# EasyEDA Pro project Power_Analyzer.eprj

# Schematic Schematic1
Board Name: Board1; Create Date: 2025-05-22; Page Name: P1; Project Name: Power_Analyzer; Schematic Name: Schematic1; Update Date: 2025-06-20; Company: EasyEDA.com; Page Size: A4; Version: V1.0
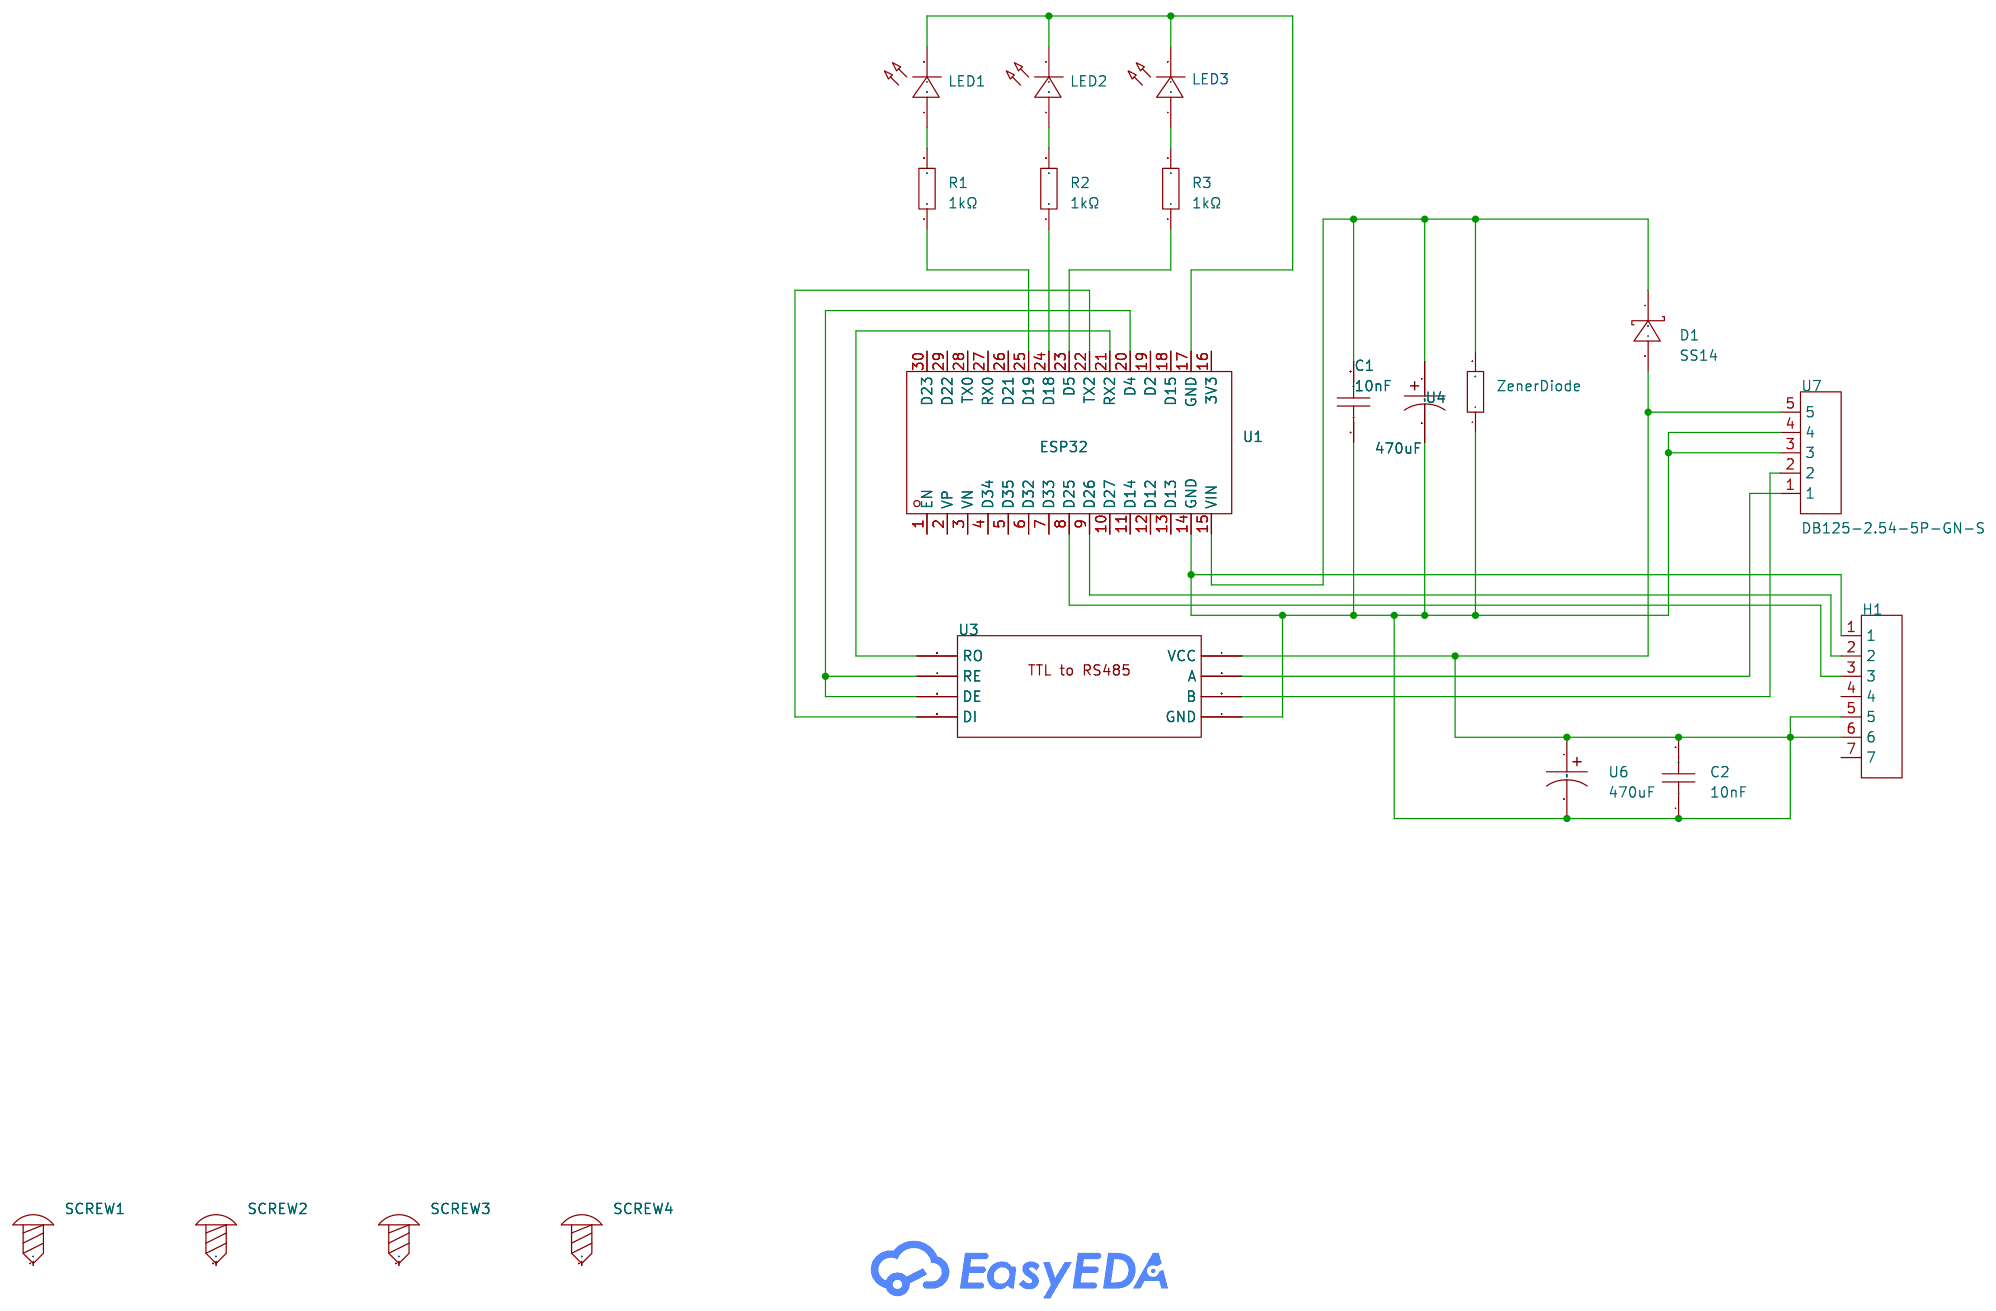
[diagram p0: schematic sheet]

## Parts
C1  10nF  [CAP-TH_L4.9-W3.7-P5.08-D0.5]
C2  10nF  [CAP-TH_L4.9-W3.7-P5.08-D0.5]
D1  SS14  [SMA_L4.2-W2.6-LS5.3-RD]
H1  -  [HDR-TH_7P-P2.54-V-M]
LED1  -  [LED-TH_BD3.0-P2.54-FD]
LED2  -  [LED-TH_BD3.0-P2.54-FD]
LED3  -  [LED-TH_BD3.0-P2.54-FD]
R1  1kΩ  [RES-TH_BD1.8-L3.2-P7.20-D0.4]
R2  1kΩ  [RES-TH_BD1.8-L3.2-P7.20-D0.4]
R3  1kΩ  [RES-TH_BD1.8-L3.2-P7.20-D0.4]
SCREW1  -  [Screw-Hole-M2]
SCREW2  -  [Screw-Hole-M2]
SCREW3  -  [Screw-Hole-M2]
SCREW4  -  [Screw-Hole-M2]
U1  ESP32  [COMM-TH_L43.7-W25.4-P2.54_NODEMCU]
U3  -  [HDR-TH_8P-P2.54-V-F-R2-C4-S2.54-1]
U4  470uF  [CAP-TH_BD8.0-P3.50-D0.5-FD]
U6  470uF  [CAP-TH_BD8.0-P3.50-D0.5-FD]
U7  DB125-2.54-5P-GN-S  [CONN-TH_DB125-2.54-5P-GN]
ZenerDiode  10kΩ  [RES-TH_BD1.8-L3.2-P7.20-D0.4]

## Library data of the parts
C1 C2 = CC4-0805-CG-50V-0.01μF-J: LCSC Part Name: 10nF ±5% 50V; Supplier Part: C454414; Manufacturer: TORCH(火炬); Supplier Footprint: 插件,P=5.08mm; JLCPCB Part Class: Extended Part; Datasheet: https://atta.szlcsc.com/upload/public/pdf/source/20191118/C454606_87A680F8831C36D0FED68C45C730D46C.pdf; Supplier: LCSC; Tolerance: ±5%; Voltage Rating: 50V
D1 = SS14_C466498: Voltage - Forward(Vf@If):550mV@1A Voltage - DC Reverse(Vr):40V Current - Rectified:1A; LCSC Part Name: 电压:40V 电流:1A; Supplier Part: C466498; Manufacturer: High Diode(海德); Supplier Footprint: SMAG; JLCPCB Part Class: Extended Part; Datasheet: https://atta.szlcsc.com/upload/public/pdf/source/20191203/C466498_7630C082BAD062E870A515CCACFD1D83.pdf; Supplier: LCSC; Voltage - Forward(Vf@If): 550mV@1A; Voltage - DC Reverse(Vr): 40V; Current - Rectified: 1A
H1 = HDR-M_2.54_1x7P: Supplier Footprint: Through
LED1-LED3 = LED_TH-R_3mm: Supplier Footprint: Through
R1-R3 ZenerDiode = Res_AXIAL-1/8W: Supplier Footprint: Through
SCREW1-SCREW4 = Screw-Hole-M2: Supplier Footprint: 插件
U1 = NODEMCU(12S): CPU:- ROM Size:- Number of I/O: USB:- WIFI Protocols:- Bluetooth:- Ethernet:- Audio & Video Interface:- Multimedia Support:- Card Type:- Power Supply Type:- Power Supply:- POE Support:- Resolution:- Temperature Range:-; LCSC Part Name: wifi测试板 NODEMCU(12S); Supplier Part: C2764073; Manufacturer: Ai-Thinker(安信可); JLCPCB Part Class: Extended Part; Datasheet: https://atta.szlcsc.com/upload/public/pdf/source/20210401/C2764073_24755F314752A2828420B4B3FC3498D8.pdf; Supplier: LCSC
U3 = HDR-F-2.54_2x4: Supplier Footprint: Through
U4 U6 = 25V470uF CD110: LCSC Part Name: 470uF ±20% 25V; Supplier Part: C2960234; Manufacturer: HRK(鸿瑞凯电子); Supplier Footprint: 插件,D8xL12mm; JLCPCB Part Class: Extended Part; Datasheet: https://atta.szlcsc.com/upload/public/pdf/source/20220224/123D914837BFA78A3349BA812F212800.pdf; Supplier: LCSC; Tolerance: ±20%; Voltage Rating: 25V; Pin Spacing: 3.5mm; Diameter: 8mm; Height - Seated (Max): 12mm; Operating Temperature: -40℃~+105℃
U7 = DB125-2.54-5P-GN-S: LCSC Part Name: 1x5P 2.54mm 直插 排数:1 每排P数:5; Supplier Part: C918123; Manufacturer: DORABO(地博电气); Supplier Footprint: 插件,P=2.54mm; JLCPCB Part Class: Extended Part; Datasheet: https://atta.szlcsc.com/upload/public/pdf/source/20230106/BCD3A0BE1EB95DC3E813F1745F022035.pdf; Supplier: LCSC; Number of Positions or Pins: 1x5P; Pitch: 2.54mm; Color: Green; Mounting Type: Direct Insert; Number of Pins: 5P; Number of Rows: 1; Number of PINs Per Row: 5; Current Rating: 7A; Voltage Rating (Max): 150V; Wire Gauge - AWG: 18~26; Wire Gauge - mm2: 1; Operating Temperature: -40℃~+105℃

## Nets
$1N619: LED1.1(C) R1.2
$1N667: LED3.1(C) R3.2
$1N692: LED2.1(C) R2.2
$1N776: LED1.2(A) LED2.2(A) LED3.2(A) U1.17(GND)
$1N1442: R3.1 U1.23(D5)
$1N1448: R1.1 U1.25(D19)
$1N1455: R2.1 U1.24(D18)
$1N3122: U1.21(RX2) U3.8(RO)
$1N3135: U1.20(D4) U3.6(DE) U3.7(RE)
$1N3158: U1.22(TX2) U3.5(DI)
$1N4323: C1.2 D1.1(C) U1.15(VIN) U4.1 ZenerDiode.2
$1N5452: U3.2(B) U7.2
$1N6480: H1.2 U1.9(D26)
$1N6507: H1.3 U1.8(D25)
$1N6725: U3.3(A) U7.1
$1N7495: C1.1 C2.1 C2.2 D1.2(A) H1.1 H1.5 H1.6 U1.14(GND) U3.1(GND) U3.4(VCC) U4.2 U6.1 U6.2 U7.3 U7.4 U7.5 ZenerDiode.1

Not connected (* = marked no-connect by the designer): H1 4 7; SCREW1 1; SCREW2 1; SCREW3 1; SCREW4 1; U1 1(EN) 2(VP) 3(VN) 4(D34) 5(D35) 6(D32) 7(D33) 10(D27) 11(D14) 12(D12) 13(D13) 16(3V3) 18(D15) 19(D2) 26(D21) 27(RX0) 28(TX0) 29(D22) 30(D23)

## Notes on the sheet
- LED3

# Board PCB1
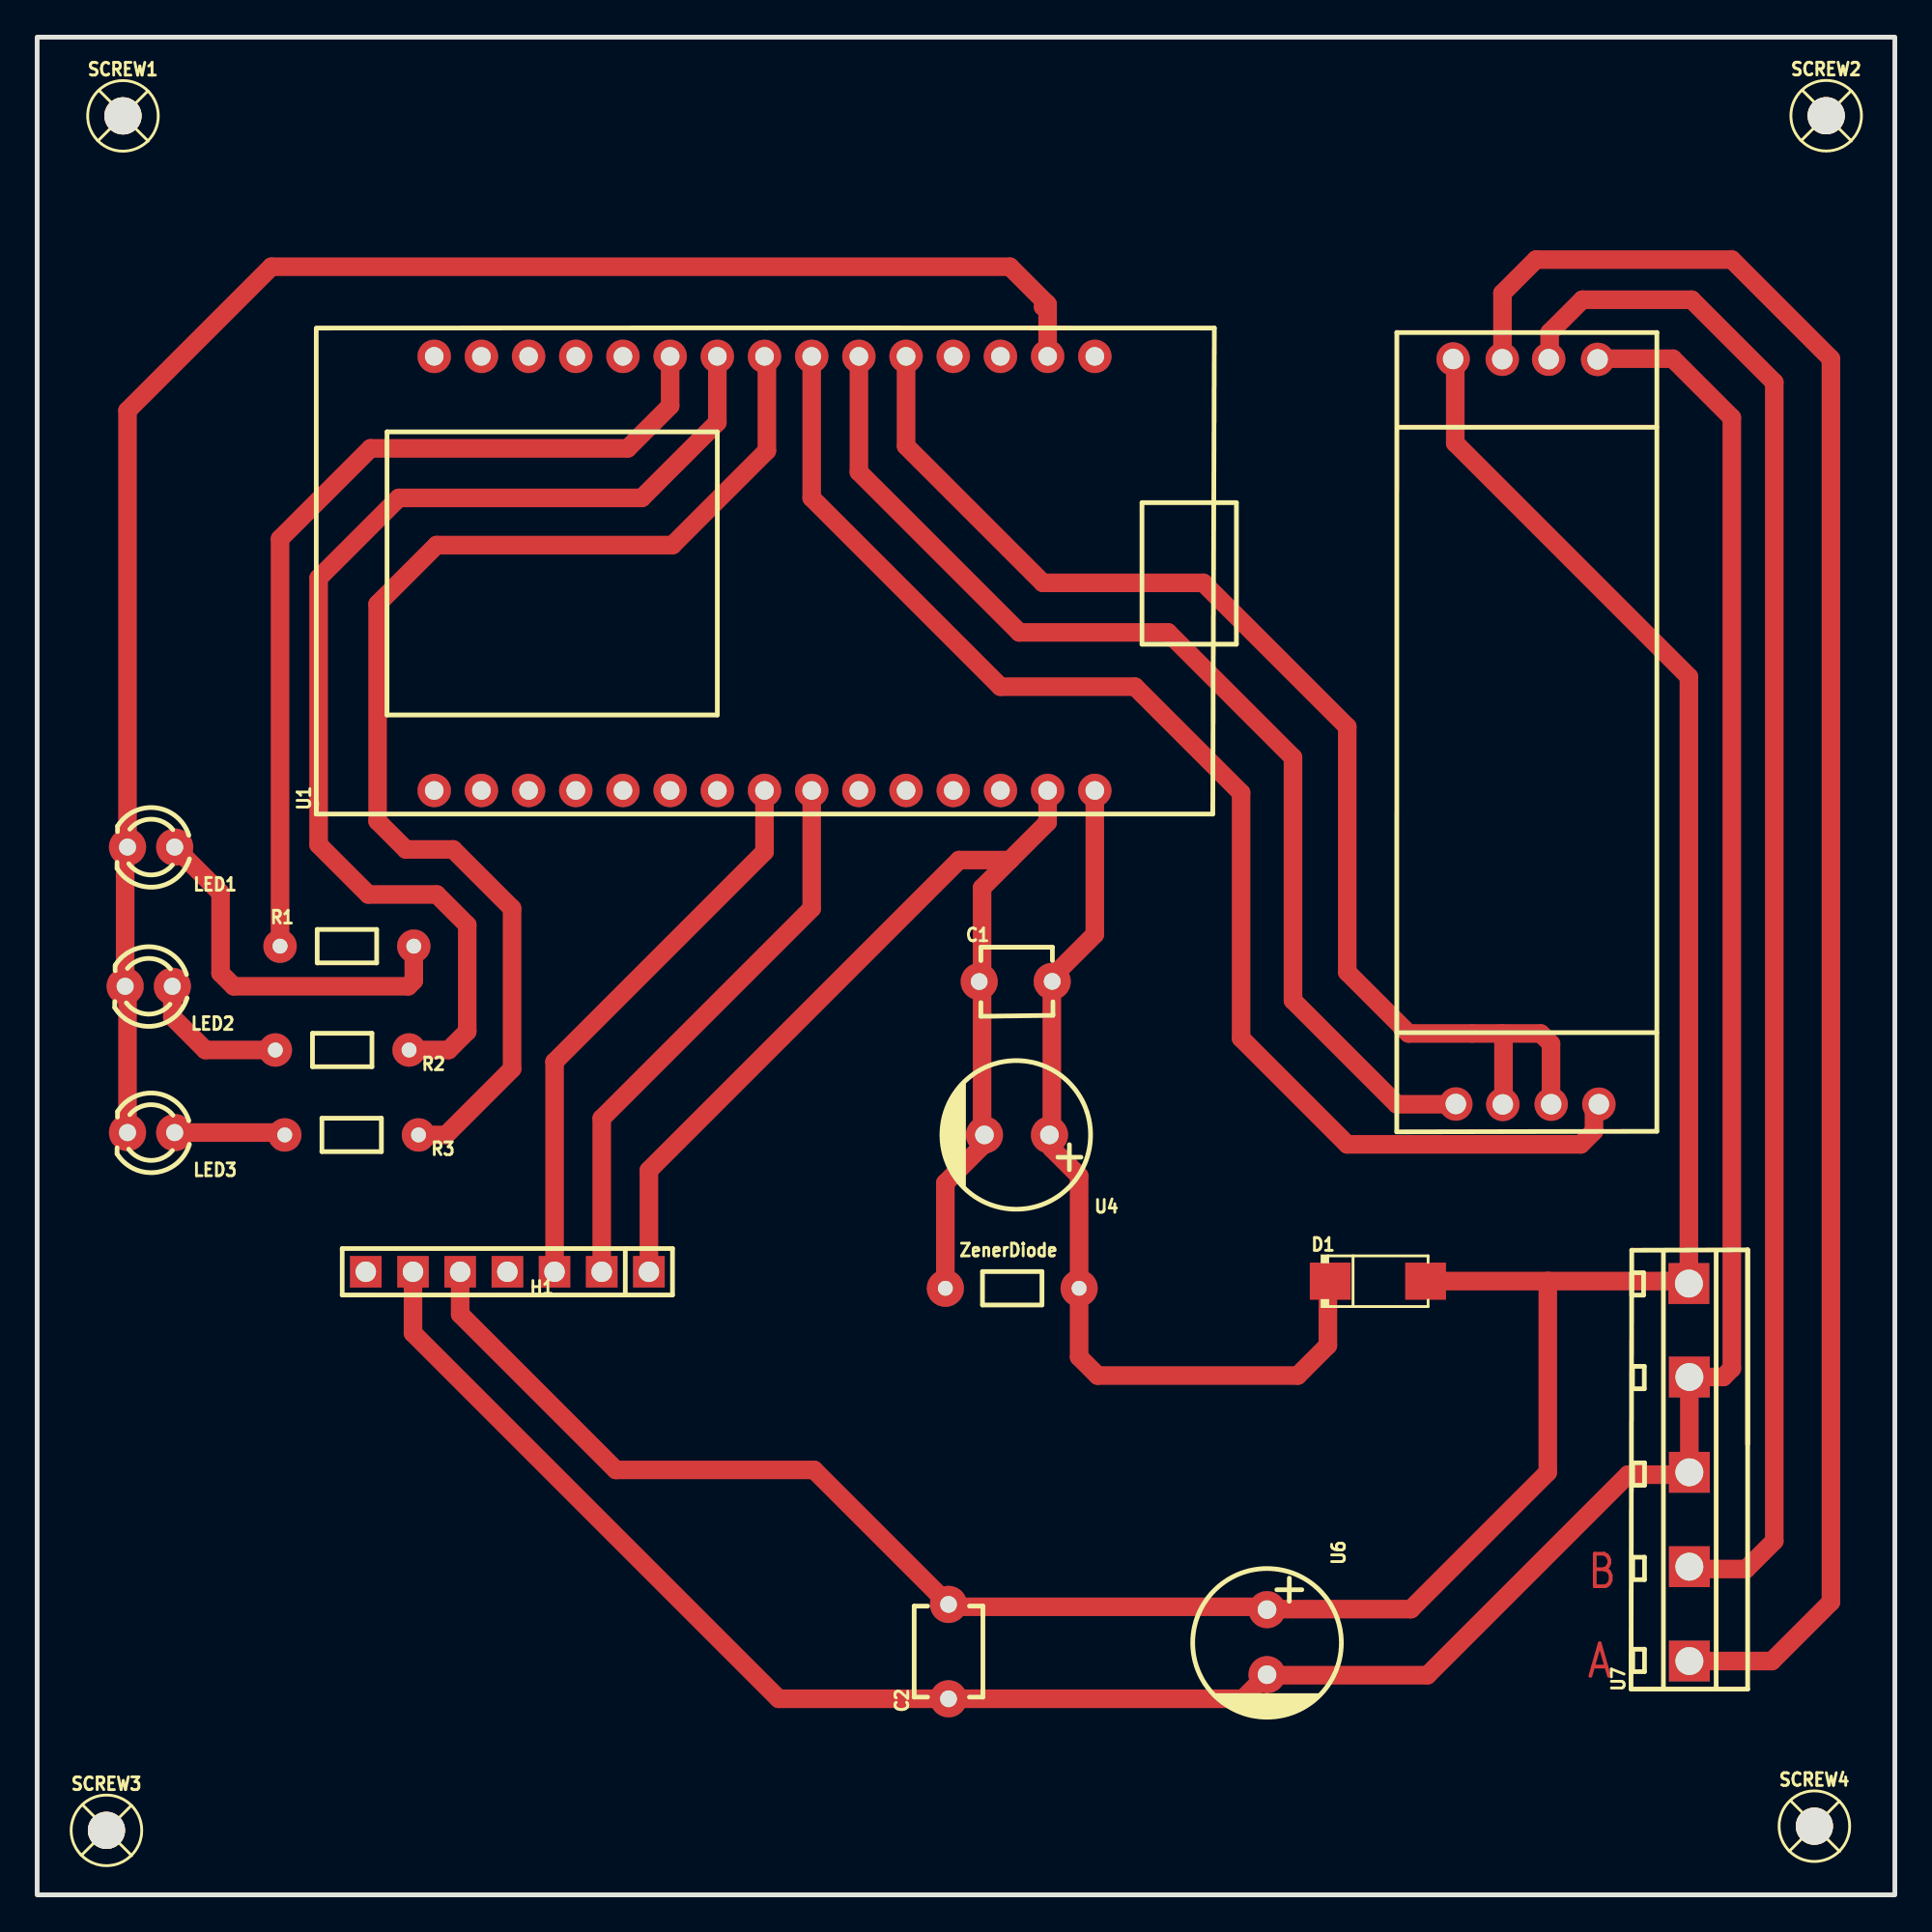
[diagram p1: board, top side]
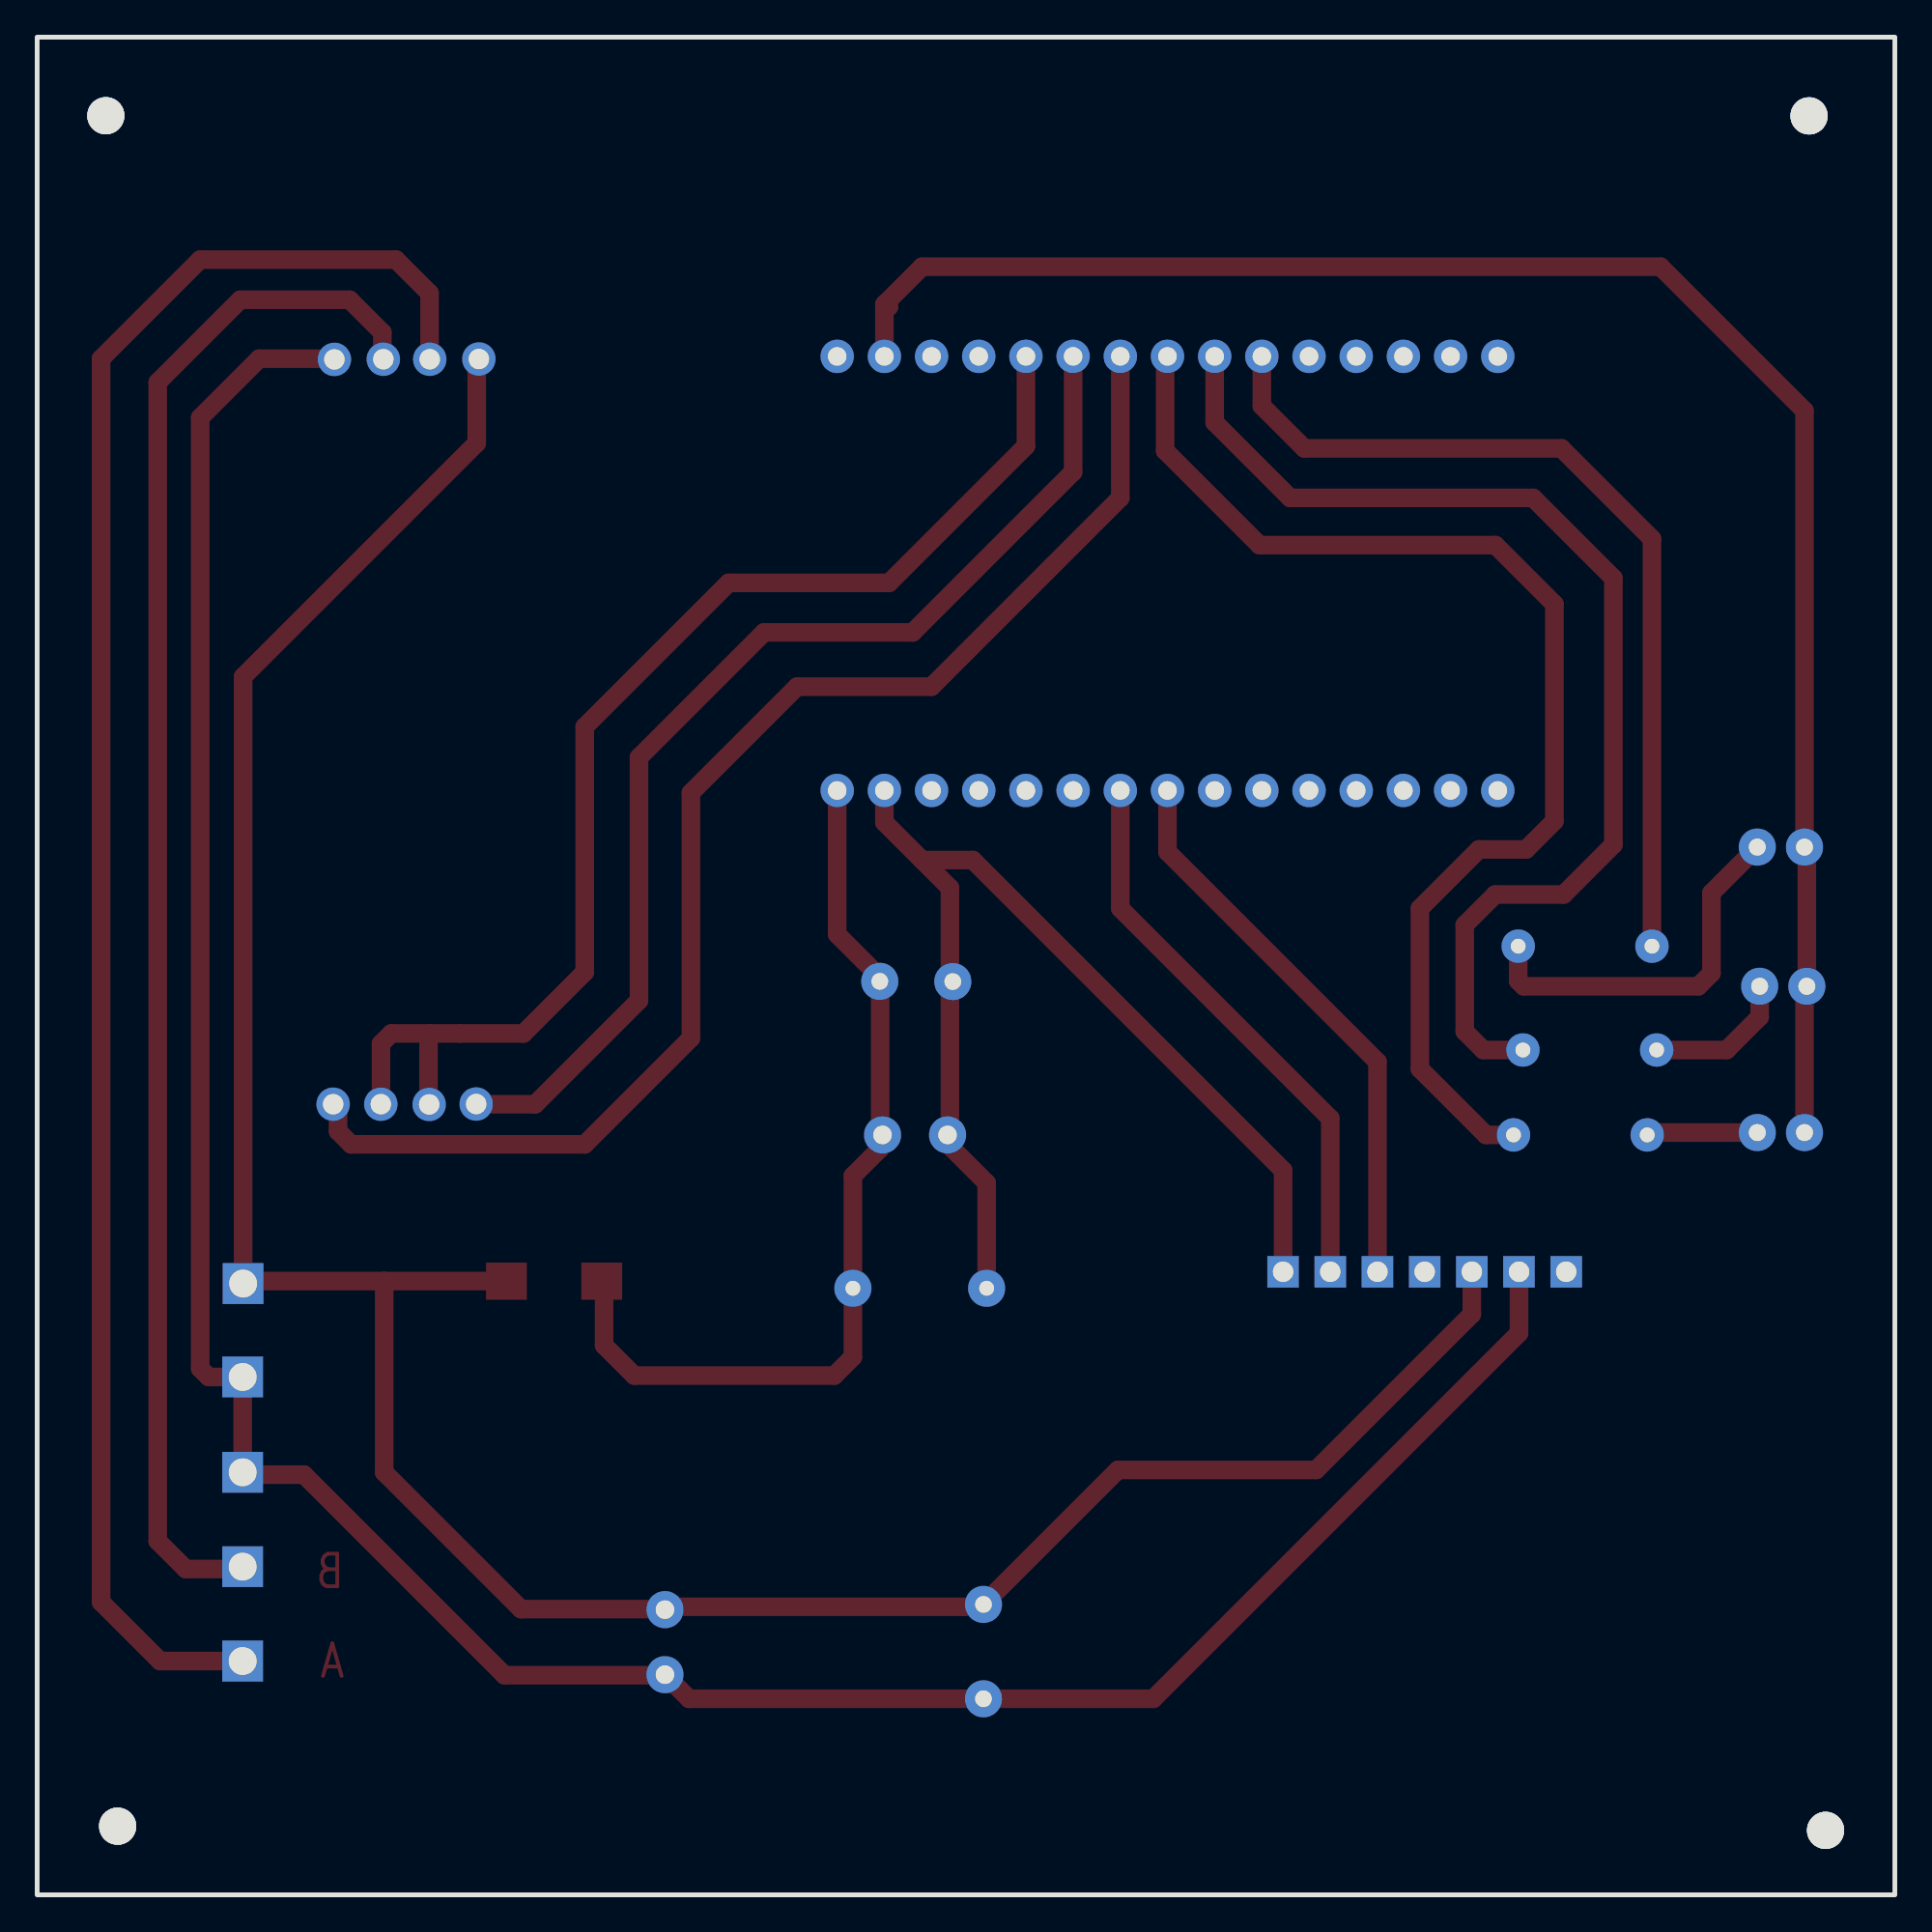
[diagram p2: board, bottom side, seen from below]

Outline 100 x 100 mm; copper layers: Top Layer, Bottom Layer. Coordinates in mm from the lower left corner of the outline.
Outline path: rectangle 0,100 100,0
Stack: Top Layer 0.035mm / Dielectric1 1.51mm FR4 er 4.5 / Bottom Layer 0.035mm

## Design rules (mm)
template: JLCPCB Capability(Two Layers Board)
spacing copperThickness1oz (default): track to track 0.102, other pairs 0.152 to 0.3
spacing copperThickness2oz: track to track 0.203, other pairs 0.152 to 0.3
track width copperThickness1oz (default): min 0.127, default 0.254, max 2.54
track width copperThickness2oz: min 0.203, default 0.254, max 2.54
differential pair differentialPair (default): width min 0.127, default 0.254, max 2.54; gap min 0.152, default 0.152
via viaSize (default): diameter min 0.5, default 0.61, max 10; hole min 0.3, default 0.305, max 6.3

## Placement (name value [footprint] x y rotation side)
C1  10nF  [CAP-TH_L4.9-W3.7-P5.08-D0.5#2]  53.25 49.16 0 top
C2  10nF  [CAP-TH_L4.9-W3.7-P5.08-D0.5]  49.06 13.09 90 top
D1  SS14  [SMA_L4.2-W2.6-LS5.3-RD]  72.17 33.03 0 top
H1  -  [HDR-TH_7P-P2.54-V-M]  25.31 33.54 180 top
LED1  -  [LED-TH_BD3.0-P2.54-FD]  6.13 56.4 180 top
LED2  -  [LED-TH_BD3.0-P2.54-FD]  6.01 48.91 180 top
LED3  -  [LED-TH_BD3.0-P2.54-FD]  6.13 41.03 180 top
R1  1kΩ  [RES-TH_BD1.8-L3.2-P7.20-D0.4]  16.67 51.07 0 top
R2  1kΩ  [RES-TH_BD1.8-L3.2-P7.20-D0.4]  16.42 45.48 180 top
R3  1kΩ  [RES-TH_BD1.8-L3.2-P7.20-D0.4]  16.93 40.91 180 top
SCREW1  -  [Screw-Hole-M2]  4.62 95.76 0 top
SCREW2  -  [Screw-Hole-M2]  96.3 95.77 0 top
SCREW3  -  [Screw-Hole-M2]  3.73 3.47 0 top
SCREW4  -  [Screw-Hole-M2]  95.67 3.7 0 top
U1  ESP32  [COMM-TH_L43.7-W25.4-P2.54_NODEMCU]  39.15 71.13 90 top
U3  -  [HDR-TH_8P-P2.54-V-F-R2-C4-S2.54-1]  83.1 69.1 270 top
U4  470uF  [CAP-TH_BD8.0-P3.50-D0.5-FD]  52.74 40.91 180 top
U6  470uF  [CAP-TH_BD8.0-P3.50-D0.5-FD]  66.21 13.6 270 top
U7  DB125-2.54-5P-GN-S  [CONN-TH_DB125-2.54-5P-GN]  88.94 17.67 90 top
ZenerDiode  10kΩ  [RES-TH_BD1.8-L3.2-P7.20-D0.4#2]  52.49 32.65 0 top

## Footprints (pads in the part's own frame, mm; a bottom-side part is the same pattern mirrored in y, then rotated)
CAP-TH_BD8.0-P3.50-D0.5-FD
  round 2 hole 1: 1(-1.75,0) 2(1.75,0)
CAP-TH_L4.9-W3.7-P5.08-D0.5
  round 2 hole 0.9: 1(-2.54,0) 2(2.54,0)
CAP-TH_L4.9-W3.7-P5.08-D0.5#2
  round 2 hole 0.9: 1(-2.54,0) 2(1.39,0.01)
COMM-TH_L43.7-W25.4-P2.54_NODEMCU
  round 1.8 hole 1: 1(-11.684,17.78) 2(-11.684,15.24) 3(-11.684,12.7) 4(-11.684,10.16) 5(-11.684,7.62) 6(-11.684,5.08) 7(-11.684,2.54) 8(-11.684,0) 9(-11.684,-2.54) 10(-11.684,-5.08) 11(-11.684,-7.62) 12(-11.684,-10.16) 13(-11.684,-12.7) 14(-11.684,-15.24) 15(-11.684,-17.78) 16(11.684,-17.78) 17(11.684,-15.24) 18(11.684,-12.7) 19(11.684,-10.16) 20(11.684,-7.62) 21(11.684,-5.08) 22(11.684,-2.54) 23(11.684,0) 24(11.684,2.54) 25(11.684,5.08) 26(11.684,7.62) 27(11.684,10.16) 28(11.684,12.7) 29(11.684,15.24) 30(11.684,17.78)
CONN-TH_DB125-2.54-5P-GN
  rect 2.2x2.2 hole 1.5: 1(-5.08,0) 2(0,0) 3(5.08,0) 4(10.211,0) 5(15.24,0.025)
HDR-TH_7P-P2.54-V-M
  rect 1.7x1.7 hole 1.1: 1(-7.62,0) 2(-5.08,0) 3(-2.54,0) 4(0,0) 5(2.54,0) 6(5.08,0) 7(7.62,0)
HDR-TH_8P-P2.54-V-F-R2-C4-S2.54-1
  round 1.8 hole 1.1: 1(-13.552,0.904) 2(-13.563,-1.73) 3(-13.562,-4.229) 4(-13.573,-6.874) 5(26.541,0.972) 6(26.54,-1.596) 7(26.552,-4.199) 8(26.53,-6.728)
LED-TH_BD3.0-P2.54-FD
  round 2 hole 0.914: 1(-1.27,0) 2(1.27,0)
RES-TH_BD1.8-L3.2-P7.20-D0.4
  round 1.8 hole 0.8: 1(-3.6,0) 2(3.6,0)
RES-TH_BD1.8-L3.2-P7.20-D0.4#2
  round 2 hole 0.8: 1(-3.6,0) 2(3.6,0)
Screw-Hole-M2
  round 2 hole 2: 1(0,0)
SMA_L4.2-W2.6-LS5.3-RD
  rect 2.2x2 smd: 1(-2.566,0) 2(2.566,0)

## Nets
As in the schematic.

Pads without a net: H1 4 7; SCREW1 1; SCREW2 1; SCREW3 1; SCREW4 1; U1 1 2 3 4 5 6 7 10 11 12 13 16 18 19 26 27 28 29 30

## Routing (per net, layer and track width the routed paths; a pad name or vN(x,y) marks a point on that pad's centre or on a via; arc(x,y) is an arc through that point)
$1N619: length 20.5
  Top Layer w1: 20.28,51.07 20.28,49.21 19.98,48.91 10.58,48.91 9.87,49.61 9.87,53.93 LED1.1
$1N667: length 6
  Top Layer w1: 13.33,40.91 13.2,41.03 LED3.1
$1N692: length 7.9
  Top Layer w1: LED2.1 7.28,47.26 9.06,45.48 12.82,45.48
$1N776: length 95.9
  Top Layer w1: 54.33,85.67 52.36,87.64 12.61,87.64 4.86,79.9 LED1.2 4.74,56.27 4.74,48.91 4.86,48.78 LED3.2 ; 54.33,85.67 54.39,85.61 54.39,82.56 ; 54.33,85.67 54.14,85.48
$1N1442: length 65.3
  Top Layer w1: R3.1 22.01,40.91 25.56,44.46 25.56,53.1 22.39,56.27 19.85,56.27 18.33,57.8 18.33,69.48 21.5,72.66 34.2,72.66 39.28,77.74 39.28,82.44 39.15,82.56
$1N1448: length 48.3
  Top Layer w1: 34.07,82.56 34.07,80.15 31.79,77.86 17.94,77.86 13.08,72.99 R1.1
$1N1455: length 61.7
  Top Layer w1: 36.61,82.56 36.61,79.26 32.55,75.2 19.47,75.2 15.15,70.88 15.15,56.53 17.83,53.85 21.51,53.85 23.15,52.21 23.15,46.48 22.15,45.48 R2.1
$1N3122: length 60
  Top Layer w1: 44.23,82.56 44.23,76.59 52.87,67.96 60.87,67.96 67.6,61.23 67.6,48.15 73.19,42.56 76.18,42.56 76.4,42.78
$1N3135: length 67.3
  Top Layer w1: 78.85,46.37 73.82,46.37 70.52,49.67 70.52,62.88 62.78,70.62 54.14,70.62 46.77,77.99 46.77,82.56 ; 78.85,46.37 78.93,46.29 78.93,42.58 78.9,42.55 ; 78.85,46.37 80.94,46.37 81.49,45.81 81.49,42.79 81.48,42.78
$1N3158: length 73.7
  Top Layer w1: 84.02,42.78 83.8,42.56 83.8,41.11 83.1,40.4 70.52,40.4 64.81,46.11 64.81,59.32 59.09,65.04 51.85,65.04 41.69,75.2 41.69,82.56
$1N4323: length 50.3
  Top Layer w1: D1.1 69.48,32.91 69.48,29.58 67.86,27.95 57.09,27.95 56.09,28.95 ZenerDiode.2 56.09,38.7 54.62,40.17 54.62,49.39 56.93,51.7 56.93,59.7
$1N5452: length 83.7
  Top Layer w1: 89.08,17.54 92,17.54 93.51,19.05 93.51,81.42 89.06,85.86 83.18,85.86 81.42,84.1 81.42,82.44
$1N6480: length 30.8
  Top Layer w1: 41.69,59.7 41.69,53.1 30.39,41.8 30.39,33.54
$1N6507: length 30.8
  Top Layer w1: 39.15,59.7 39.15,56.15 27.85,44.84 H1.3
$1N6725: length 100.3
  Top Layer w1: 78.88,82.44 78.88,86.22 80.68,88.02 91.22,88.02 96.56,82.69 96.56,15.76 93.38,12.59 U7.1
$1N7495: length 364
  Top Layer w1: 81.32,33.04 74.87,33.04 74.74,32.91 ; 81.32,33.04 88.78,33.04 U7.5 88.91,65.57 76.34,78.14 76.34,82.44 ; 81.32,33.04 81.32,22.75 73.95,15.38 66.36,15.38 66.23,15.51 ; H1.6 20.23,30.24 39.92,10.55 C2.1 64.91,10.55 U6.2 66.23,11.82 74.84,11.82 85.64,22.62 89.06,22.62 ; 52.36,55.7 54.39,57.73 54.39,59.7 ; 52.36,55.7 49.63,55.7 32.93,39 H1.1 ; 52.36,55.7 50.87,54.21 50.87,40.3 48.89,38.32 ZenerDiode.1 48.76,32.53 ; 66.23,15.51 49.19,15.51 C2.2 41.82,22.87 31.15,22.87 22.77,31.25 H1.5 ; 66.23,15.51 U6.1 ; U7.3 U7.4 90.77,27.88 91.22,28.33 91.22,79.52 88.05,82.69 84.21,82.69 83.96,82.44

## Text on the board
Top Layer: A | B | - | + | C
